# Altium project PCB_Project1.PrjPCB
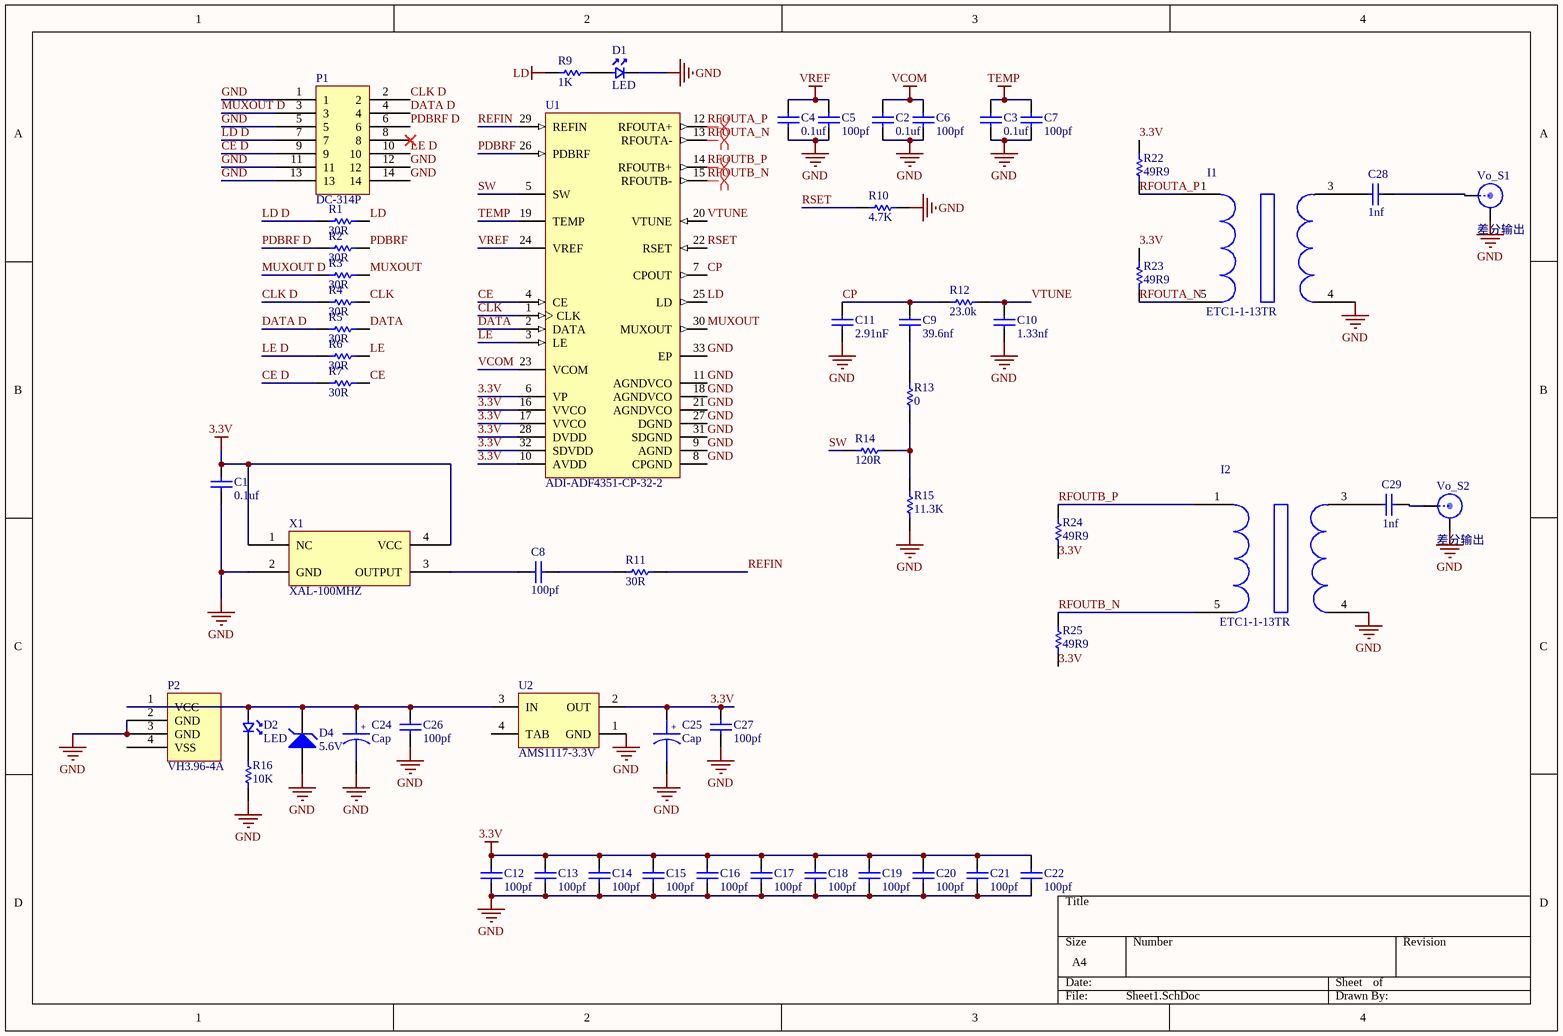
[diagram p0: Sheet1.SchDoc]
1 sheet, 59 parts. Net scope: global (net labels, ports and power ports of the same name join across sheets).
Board file: PCB2.PcbDoc

## Sheet Sheet1.SchDoc
size A4

### Parts
C1  0.1uf  [0805]
C2  0.1uf  [0805]
C3  0.1uf  [0805]
C4  0.1uf  [0805]
C5  100pf  [0805]
C6  100pf  [0805]
C7  100pf  [0805]
C8  100pf  [0805]
C9  39.6nf  [0805]
C10  1.33nf  [0805]
C11  2.91nF  [0805]
C12  100pf  [0805]
C13  100pf  [0805]
C14  100pf  [0805]
C15  100pf  [0805]
C16  100pf  [0805]
C17  100pf  [0805]
C18  100pf  [0805]
C19  100pf  [0805]
C20  100pf  [0805]
C21  100pf  [0805]
C22  100pf  [0805]
C24  Cap  [7343C-TYPE_D]
C25  Cap  [7343C-TYPE_D]
C26  100pf  [0805]
C27  100pf  [0805]
C28  1nf  [0805]
C29  1nf  [0805]
D1  LED  [0805_s]
D2  LED  [0805_s]
D4  5.6V  [SMA/DO-214AC]
I1  ETC1-1-13TR  [SM-22]
I2  ETC1-1-13TR  [SM-22]
P1  DC-314P  [DC3-14P]
P2  VH3.96-4A  [VH3.96-4P]
R1  30R  [0805]
R2  30R  [0805]
R3  30R  [0805]
R4  30R  [0805]
R5  30R  [0805]
R6  30R  [0805]
R7  30R  [0805]
R9  1K  [0805]
R10  4.7K  [0805]
R11  30R  [0805]
R12  23.0k  [0805]
R13  0  [0805]
R14  120R  [0805]
R15  11.3K  [0805]
R16  10K  [0805]
R22  49R9  [0805]
R23  49R9  [0805]
R24  49R9  [0805]
R25  49R9  [0805]
U1  ADI-ADF4351-CP-32-2  [ADI-CP-32-2_M]
U2  AMS1117-3.3V  [SOT-223]
Vo_S1  差分输出  [SMA-LYING]
Vo_S2  差分输出  [SMA-LYING]
X1  XAL-100MHZ  [SMD4_7050]

### Nets
3.3V: C1.2 C12.2 C13.2 C14.2 C15.2 C16.2 C17.2 C18.2 C19.2 C20.2 C21.2 C22.2 C25.1 C27.2 R22.2 R23.1 R24.1 R25.1 U1.6(VP) U1.10(AVDD) U1.16(VVCO) U1.17(VVCO) U1.28(DVDD) U1.32(SDVDD) U2.2(OUT) X1.1(NC) X1.4(VCC)
GND: C1.1 C2.1 C3.1 C4.1 C5.1 C6.1 C7.1 C10.1 C11.1 C12.1 C13.1 C14.1 C15.1 C16.1 C17.1 C18.1 C19.1 C20.1 C21.1 C22.1 C24.2 C25.2 C26.1 C27.1 D1.1 D4.1(A) I1.4 I2.4 P1.1 P1.5 P1.11 P1.12 P1.13 P1.14 P2.2(GND) P2.3(GND) R10.2 R15.2 R16.1 U1.8(CPGND) U1.9(AGND) U1.11(AGNDVCO) U1.18(AGNDVCO) U1.21(AGNDVCO) U1.27(DGND) U1.31(SDGND) U1.33(EP) U2.1(GND) Vo_S1.1 Vo_S2.1 X1.2(GND)
LD: R1.2 R9.1 U1.25(LD)
TEMP: C3.2 C7.2 U1.19(TEMP)
VCOM: C2.2 C6.2 U1.23(VCOM)
VREF: C4.2 C5.2 U1.24(VREF)
CE: R7.2 U1.4(CE)
CE D: P1.9 R7.1
CLK: R4.2 U1.1(CLK)
CLK D: P1.2 R4.1
CP: C9.2 C11.2 R12.1 U1.7(CPOUT)
DATA: R5.2 U1.2(DATA)
DATA D: P1.4 R5.1
LD D: P1.7 R1.1
LE: R6.2 U1.3(LE)
LE D: P1.10 R6.1
MUXOUT: R3.2 U1.30(MUXOUT)
MUXOUT D: P1.3 R3.1
PDBRF: R2.2 U1.26(PDBRF)
PDBRF D: P1.6 R2.1
REFIN: R11.1 U1.29(REFIN)
RFOUTA_N: I1.5 R23.2 U1.13(RFOUTA-)
RFOUTA_P: I1.1 R22.1 U1.12(RFOUTA+)
RFOUTB_N: I2.5 R25.2 U1.15(RFOUTB-)
RFOUTB_P: I2.1 R24.2 U1.14(RFOUTB+)
RSET: R10.1 U1.22(RSET)
SW: R14.2 U1.5(SW)
VTUNE: C10.2 R12.2 U1.20(VTUNE)
NetC8_1: C8.1 R11.2
NetC8_2: C8.2 X1.3(OUTPUT)
NetC9_1: C9.1 R13.2
NetC24_1: C24.1 C26.2 D2.2 D4.2(K) P2.1(VCC) U2.3(IN)
NetC28_1: C28.1 I1.3
NetC28_2: C28.2 Vo_S1.0
NetC29_1: C29.1 I2.3
NetC29_2: C29.2 Vo_S2.0
NetD1_2: D1.2 R9.2
NetD2_1: D2.1 R16.2
NetR13_1: R13.1 R14.1 R15.1

Not connected (* = marked no-connect by the designer): P1 8*; P2 4(VSS); U2 4(TAB)

### Layout directives
differential pair: RFOUTA_N, RFOUTA_P, RFOUTB_N, RFOUTB_P

### Notes on the sheet
- (in symbol Tantalium Cap) +
- (in symbol Cap) +

### Library data of the parts
C1-C22 C26-C29 = Cap
C24 C25 = Tantalium Cap
D4 = 肖特基-5.6V
P1 = DC3-14P
R1-R7 R9-R16 R22-R25 = Res
Vo_S1 Vo_S2 = SMA
X1 = XAL